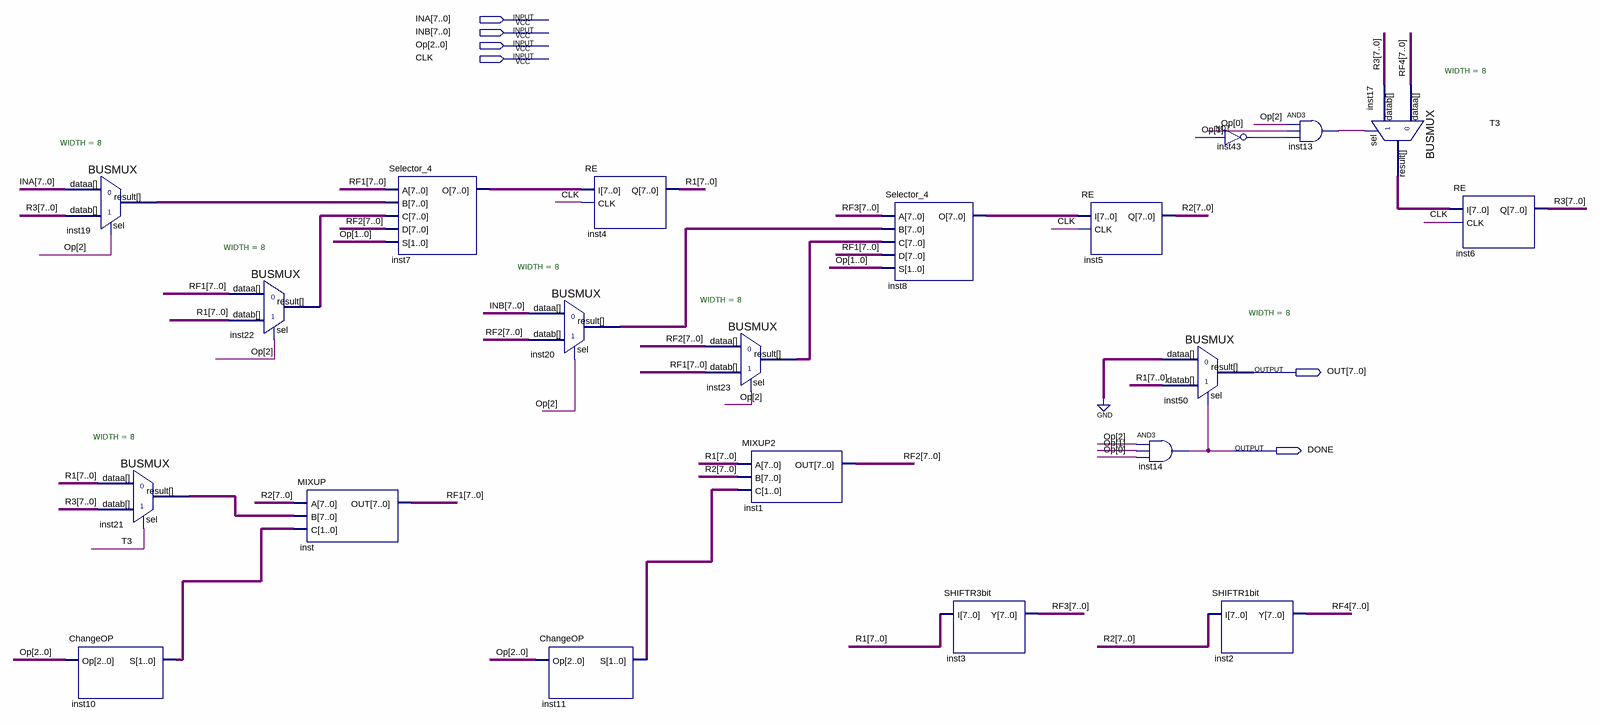
[diagram p0: schematic sheet]
// Quartus schematic Datapath2.bdf as structural Verilog: 21 symbols, 6 pins
module Datapath2 (
  input  [7:0] INA,
  input  [7:0] INB,
  input  [2:0] Op,
  input  CLK,
  output [7:0] OUT,
  output DONE
);

  wire inst43_out, T3;
  wire [1:0] inst10_s, inst11_s;
  wire [7:0] inst7_o, inst8_o, inst17_result, inst19_result, inst20_result, inst21_result, inst22_result,
       inst23_result, R1, R2, R3, RF1, RF2, RF3, RF4;

  BUSMUX #(.WIDTH(8)) inst19 (.datab(R3), .sel(Op[2]), .dataa(INA), .result(inst19_result));
  ChangeOP inst10 (.Op(Op), .S(inst10_s));
  BUSMUX #(.WIDTH(8)) inst21 (.datab(R3), .sel(T3), .dataa(R1), .result(inst21_result));
  BUSMUX #(.WIDTH(8)) inst22 (.datab(R1), .sel(Op[2]), .dataa(RF1), .result(inst22_result));
  MIXUP inst (.A(R2), .B(inst21_result), .C(inst10_s), .OUT(RF1));
  Selector_4 inst7 (.A(RF1), .B(inst19_result), .C(inst22_result), .D(RF2), .S(Op[1:0]), .O(inst7_o));
  BUSMUX #(.WIDTH(8)) inst20 (.datab(RF2), .sel(Op[2]), .dataa(INB), .result(inst20_result));
  ChangeOP inst11 (.Op(Op), .S(inst11_s));
  RE inst4 (.I(inst7_o), .CLK(CLK), .Q(R1));
  BUSMUX #(.WIDTH(8)) inst23 (.datab(RF1), .sel(Op[2]), .dataa(RF2), .result(inst23_result));
  MIXUP2 inst1 (.A(R1), .B(R2), .C(inst11_s), .OUT(RF2));
  Selector_4 inst8 (.A(RF3), .B(inst20_result), .C(inst23_result), .D(RF1), .S(Op[1:0]), .O(inst8_o));
  SHIFTR3bit inst3 (.I(R1), .Y(RF3));
  RE inst5 (.I(inst8_o), .CLK(CLK), .Q(R2));
  BUSMUX #(.WIDTH(8)) inst50 (.datab(R1), .sel(DONE), .dataa({8{1'b0}}), .result(OUT));
  and inst14 (DONE, Op[2], Op[1], Op[0]);
  not inst43 (inst43_out, Op[1]);
  SHIFTR1bit inst2 (.I(R2), .Y(RF4));
  and inst13 (T3, Op[2], Op[0], inst43_out);
  BUSMUX #(.WIDTH(8)) inst17 (.datab(R3), .sel(T3), .dataa(RF4), .result(inst17_result));
  RE inst6 (.I(inst17_result), .CLK(CLK), .Q(R3));
endmodule
